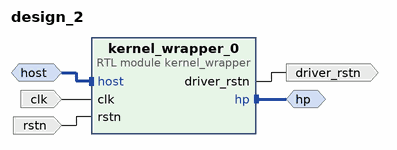
[diagram p0: block diagram of the top level]
# Vivado block design design_2, xczu19eg-ffvd1760-2-e, Vivado 2021.2
create_bd_design design_2

create_bd_intf_port -mode Master -vlnv xilinx.com:interface:aximm_rtl:1.0 hp
set_property -dict [list \
  CONFIG.ADDR_WIDTH 48 \
  CONFIG.DATA_WIDTH 128 \
  CONFIG.HAS_CACHE 0 \
  CONFIG.HAS_LOCK 0 \
  CONFIG.HAS_PROT 0 \
  CONFIG.HAS_QOS 0 \
  CONFIG.HAS_REGION 0 \
  CONFIG.NUM_READ_OUTSTANDING 2 \
  CONFIG.NUM_WRITE_OUTSTANDING 2 \
  CONFIG.PROTOCOL AXI4 \
] [get_bd_intf_ports hp]
create_bd_intf_port -mode Slave -vlnv xilinx.com:interface:aximm_rtl:1.0 host
set_property -dict [list \
  CONFIG.ADDR_WIDTH 32 \
  CONFIG.ARUSER_WIDTH 0 \
  CONFIG.AWUSER_WIDTH 0 \
  CONFIG.BUSER_WIDTH 0 \
  CONFIG.DATA_WIDTH 32 \
  CONFIG.HAS_BRESP 1 \
  CONFIG.HAS_BURST 0 \
  CONFIG.HAS_CACHE 0 \
  CONFIG.HAS_LOCK 0 \
  CONFIG.HAS_PROT 0 \
  CONFIG.HAS_QOS 0 \
  CONFIG.HAS_REGION 0 \
  CONFIG.HAS_RRESP 1 \
  CONFIG.HAS_WSTRB 1 \
  CONFIG.ID_WIDTH 0 \
  CONFIG.MAX_BURST_LENGTH 1 \
  CONFIG.NUM_READ_OUTSTANDING 1 \
  CONFIG.NUM_READ_THREADS 1 \
  CONFIG.NUM_WRITE_OUTSTANDING 1 \
  CONFIG.NUM_WRITE_THREADS 1 \
  CONFIG.PROTOCOL AXI4LITE \
  CONFIG.READ_WRITE_MODE READ_WRITE \
  CONFIG.RUSER_BITS_PER_BYTE 0 \
  CONFIG.RUSER_WIDTH 0 \
  CONFIG.SUPPORTS_NARROW_BURST 0 \
  CONFIG.WUSER_BITS_PER_BYTE 0 \
  CONFIG.WUSER_WIDTH 0 \
] [get_bd_intf_ports host]
create_bd_port -dir I -type clk clk
set_property -dict {CONFIG.ASSOCIATED_BUSIF hp:host CONFIG.ASSOCIATED_RESET rstn} [get_bd_ports clk]
create_bd_port -dir I -type rst rstn
create_bd_port -dir O -type rst driver_rstn

create_bd_cell -type module -reference kernel_wrapper kernel_wrapper_0

# ---- connections ----

connect_bd_intf_net -intf_net host_0_1 [get_bd_intf_ports host] [get_bd_intf_pins kernel_wrapper_0/host]
connect_bd_intf_net [get_bd_intf_ports hp] [get_bd_intf_pins kernel_wrapper_0/hp]
connect_bd_net -net clk_0_1 [get_bd_ports clk] [get_bd_pins kernel_wrapper_0/clk]
connect_bd_net [get_bd_pins kernel_wrapper_0/driver_rstn] [get_bd_ports driver_rstn]
connect_bd_net -net rstn_0_1 [get_bd_ports rstn] [get_bd_pins kernel_wrapper_0/rstn]

# ---- address map ----
assign_bd_address -offset 0x00000000 -range 4G -target_address_space [get_bd_addr_spaces host] [get_bd_addr_segs kernel_wrapper_0/host/reg0]
assign_bd_address -offset 0x000000000000 -range 256T -target_address_space [get_bd_addr_spaces kernel_wrapper_0/hp] [get_bd_addr_segs hp/Reg]

validate_bd_design
save_bd_design
